# Altium schematic sheet Mux.SchDoc
size B portrait; SheetNumber: 6; SheetTotal: 7
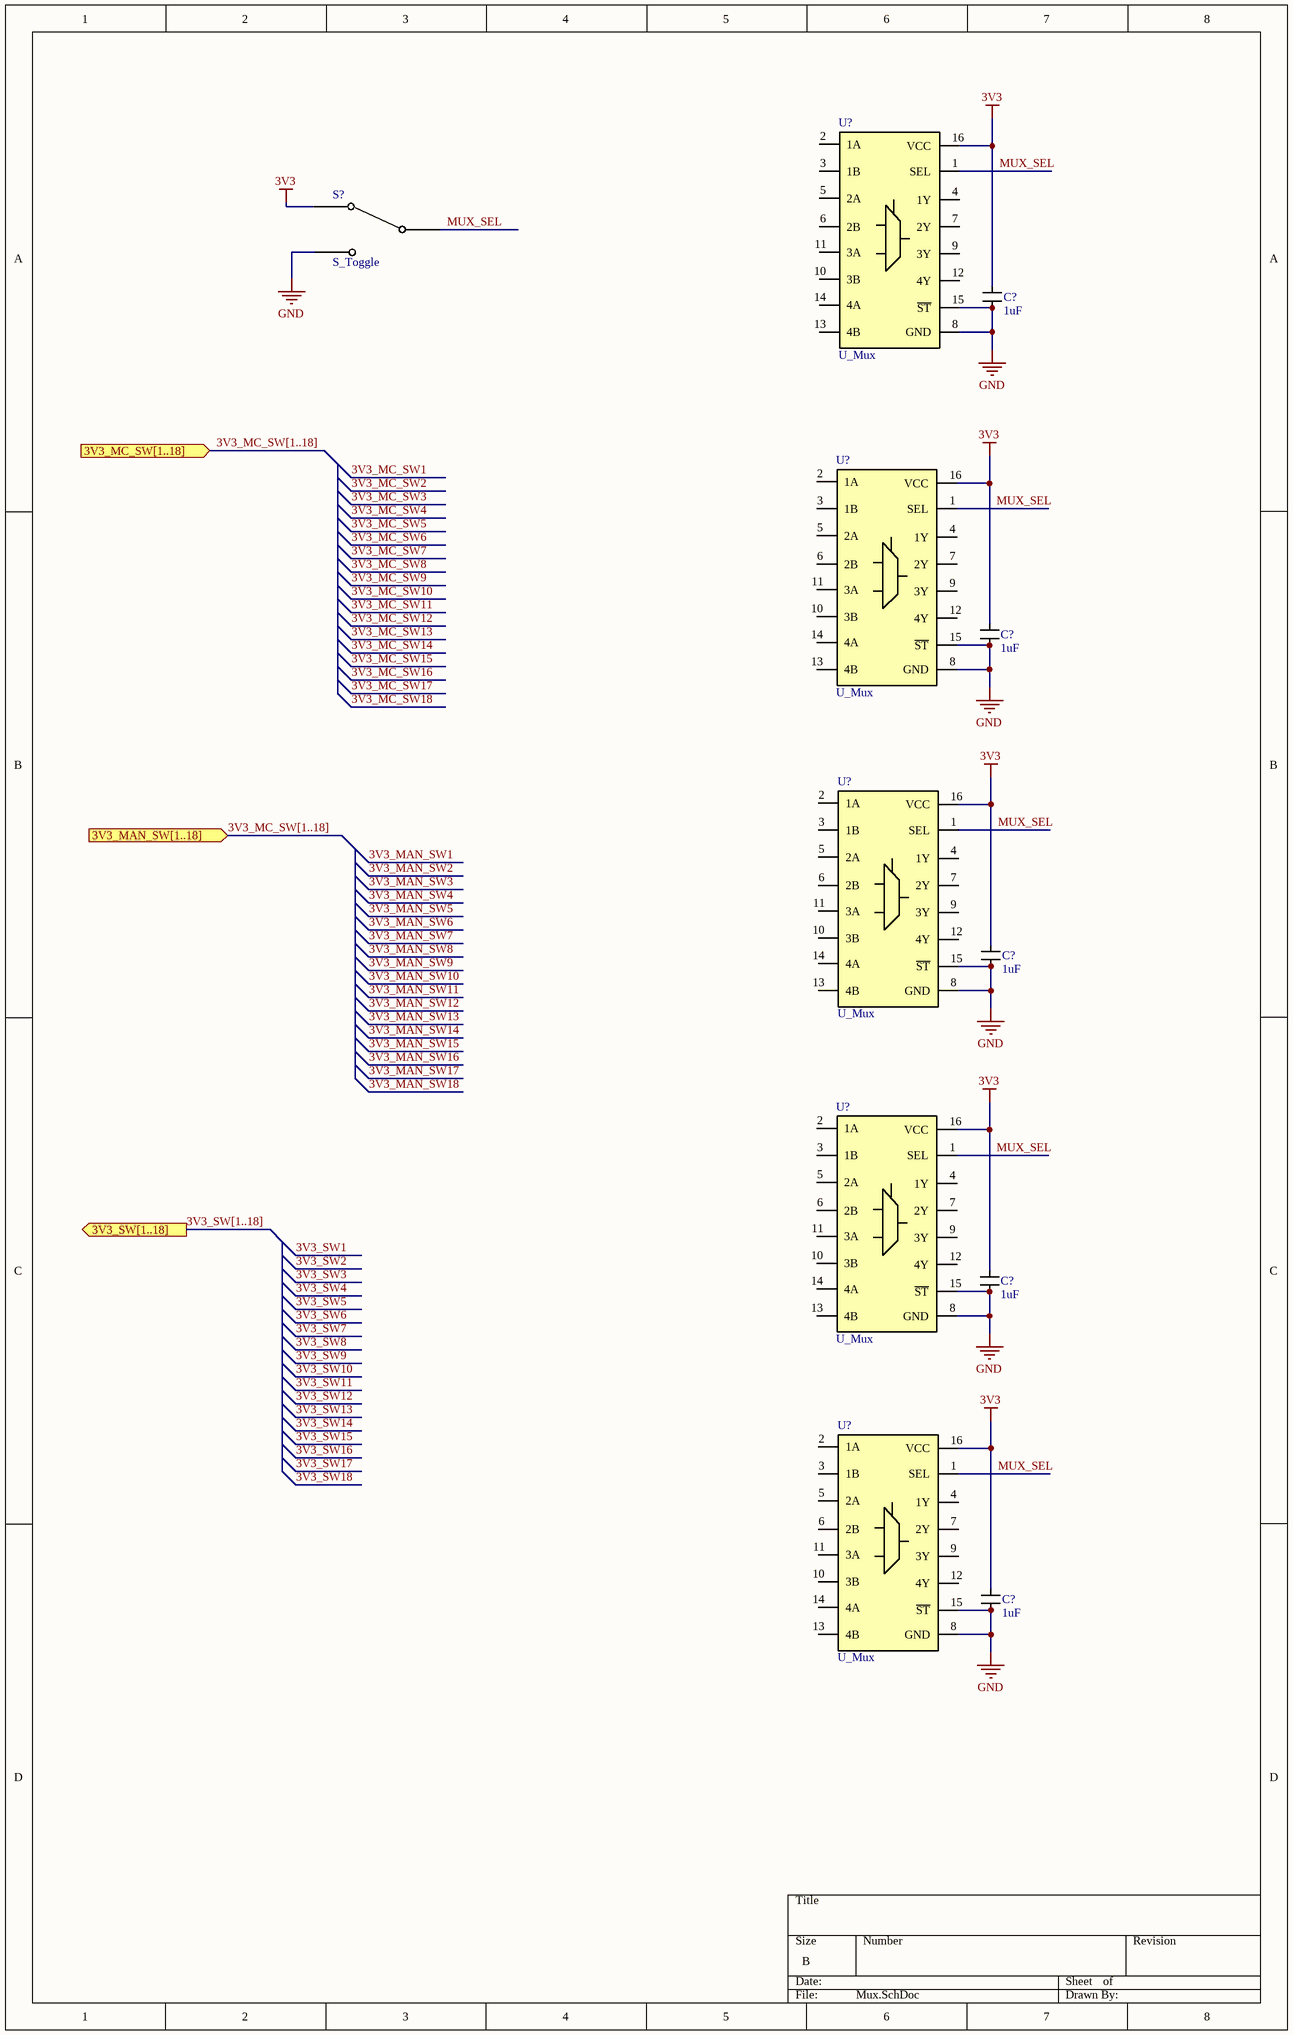
[diagram p0: Mux.SchDoc]

## Parts
(Parts that share a designator on the sheet are numbered #1, #2 ... from top to bottom, then left to right.)
C?#1  1uF  [0603_CAP]
C?#2  1uF  [0603_CAP]
C?#3  1uF  [0603_CAP]
C?#4  1uF  [0603_CAP]
C?#5  1uF  [0603_CAP]
S?  S_Toggle
U?#1  U_Mux  [TSSOP-16]
U?#2  U_Mux  [TSSOP-16]
U?#3  U_Mux  [TSSOP-16]
U?#4  U_Mux  [TSSOP-16]
U?#5  U_Mux  [TSSOP-16]

## Ports
3V3_MAN_SW[1..18] (in, see Load_Bank_Master[3C]), 3V3_MC_SW[1..18] (in, see Load_Bank_Master[3C]), 3V3_SW[1..18] (out, see Load_Bank_Master[3C], TX[1B])

## Nets
3V3: C?#1.2 C?#2.2 C?#3.2 C?#4.2 C?#5.2 S?.1 U?#1.16(VCC) U?#2.16(VCC) U?#3.16(VCC) U?#4.16(VCC) U?#5.16(VCC)
GND: C?#1.1 C?#2.1 C?#3.1 C?#4.1 C?#5.1 S?.3 U?#1.8(GND) U?#1.15(~{ST}) U?#2.8(GND) U?#2.15(~{ST}) U?#3.8(GND) U?#3.15(~{ST}) U?#4.8(GND) U?#4.15(~{ST}) U?#5.8(GND) U?#5.15(~{ST})
MUX_SEL: S?.2 U?#1.1(SEL) U?#2.1(SEL) U?#3.1(SEL) U?#4.1(SEL) U?#5.1(SEL)

Not connected (* = marked no-connect by the designer): U?#1 2(1A) 3(1B) 4(1Y) 5(2A) 6(2B) 7(2Y) 9(3Y) 10(3B) 11(3A) 12(4Y) 13(4B) 14(4A); U?#2 2(1A) 3(1B) 4(1Y) 5(2A) 6(2B) 7(2Y) 9(3Y) 10(3B) 11(3A) 12(4Y) 13(4B) 14(4A); U?#3 2(1A) 3(1B) 4(1Y) 5(2A) 6(2B) 7(2Y) 9(3Y) 10(3B) 11(3A) 12(4Y) 13(4B) 14(4A); U?#4 2(1A) 3(1B) 4(1Y) 5(2A) 6(2B) 7(2Y) 9(3Y) 10(3B) 11(3A) 12(4Y) 13(4B) 14(4A); U?#5 2(1A) 3(1B) 4(1Y) 5(2A) 6(2B) 7(2Y) 9(3Y) 10(3B) 11(3A) 12(4Y) 13(4B) 14(4A)

## Buses and harness runs
bus 3V3_MC_SW[1..18] = port 3V3_MAN_SW[1..18]
bus 3V3_MC_SW[1..18] = port 3V3_MC_SW[1..18]
bus 3V3_SW[1..18] = port 3V3_SW[1..18]

## Library data of the parts
C?#1-C?#5 = C_1uF_0603: Capacitor SMD MLCC 1 uF 0603 25 V
S? = S_Toggle: Switch Toggle
U?#1-U?#5 = U_Mux: IC 4-in-1 2-way MUX TSSOP-16